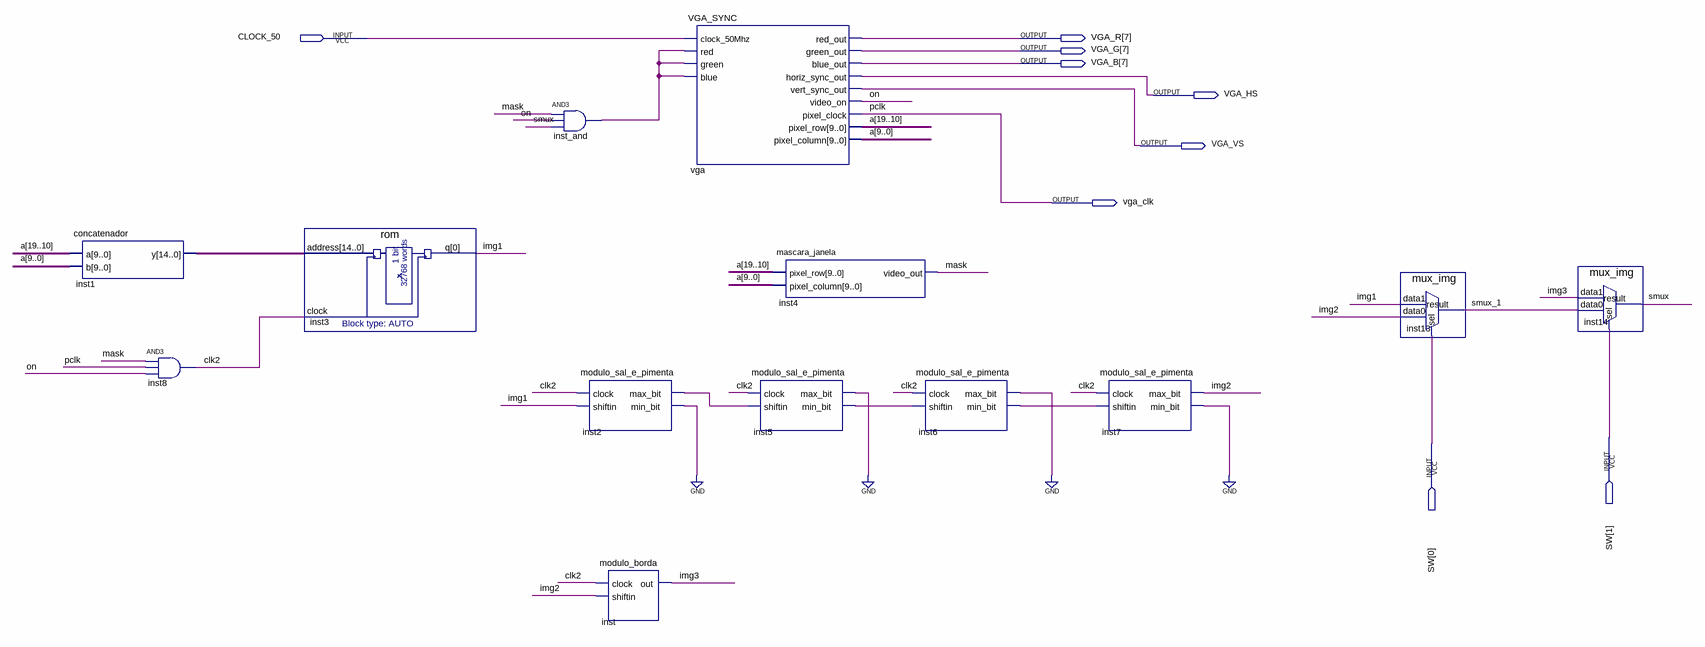
[diagram p0: schematic sheet]
// Quartus schematic vga_filtro.bdf as structural Verilog: 13 symbols, 9 pins
module vga_filtro (
  input  CLOCK_50,
  input  [1:0] SW,
  output [7:7] VGA_R,
  output [7:7] VGA_G,
  output [7:7] VGA_B,
  output VGA_HS,
  output VGA_VS,
  output vga_clk
);

  wire clk2, img1, img2, img3, inst2_max_bit, inst2_min_bit, inst5_max_bit, inst5_min_bit, inst6_max_bit,
       inst6_min_bit, inst7_min_bit, inst_and_out, mask, on, smux, smux_1;
  wire [14:0] inst1_y;
  wire [19:0] a;

  concatenador inst1 (.a(a[19:10]), .b(a[9:0]), .y(inst1_y));
  and inst8 (clk2, mask, vga_clk, on);
  rom inst3 (.address(inst1_y), .clock(clk2), .q(img1));
  and inst_and (inst_and_out, mask, on, smux);
  modulo_sal_e_pimenta inst2 (.clock(clk2), .shiftin(img1), .max_bit(inst2_max_bit), .min_bit(inst2_min_bit));
  modulo_borda inst (.clock(clk2), .shiftin(img2), .out(img3));
  VGA_SYNC vga (
    .clock_50Mhz(CLOCK_50), .red(inst_and_out), .green(inst_and_out), .blue(inst_and_out),
    .red_out(VGA_R[7]), .green_out(VGA_G[7]), .blue_out(VGA_B[7]), .horiz_sync_out(VGA_HS),
    .vert_sync_out(VGA_VS), .video_on(on), .pixel_clock(vga_clk), .pixel_row(a[19:10]), .pixel_column(a[9:0]));
  modulo_sal_e_pimenta inst5 (.clock(clk2), .shiftin(inst2_max_bit), .max_bit(inst5_max_bit), .min_bit(inst5_min_bit));
  mascara_janela inst4 (.pixel_row(a[19:10]), .pixel_column(a[9:0]), .video_out(mask));
  modulo_sal_e_pimenta inst6 (.clock(clk2), .shiftin(inst5_min_bit), .max_bit(inst6_max_bit), .min_bit(inst6_min_bit));
  modulo_sal_e_pimenta inst7 (.clock(clk2), .shiftin(inst6_min_bit), .max_bit(img2), .min_bit(inst7_min_bit));
  mux_img inst13 (.data1(img1), .data0(img2), .sel(SW[0]), .result(smux_1));
  mux_img inst14 (.data1(img3), .data0(smux_1), .sel(SW[1]), .result(smux));
  // also tied to GND on the sheet: {inst2_min_bit, inst5_max_bit, inst6_max_bit, inst7_min_bit}

  // Other names for the same wires on the sheet: pclk = vga_clk
endmodule
